# Altium project DM3370.PrjPcb (part 5 of 14)

## Sheet DM3370_Motor.SchDoc: =project_title
size Tabloid; CompanyName: Luxonis Holding; DrawnBy: David Malovrh; Organization: Luxonis Holding; Address1: 7901 Shaffer Parkway; Address2: Littleton, CO; Address3: 80127; Address4: United States; DocumentNumber: 14; Revision: R5M2E5; SheetNumber: 14; SheetTotal: 17
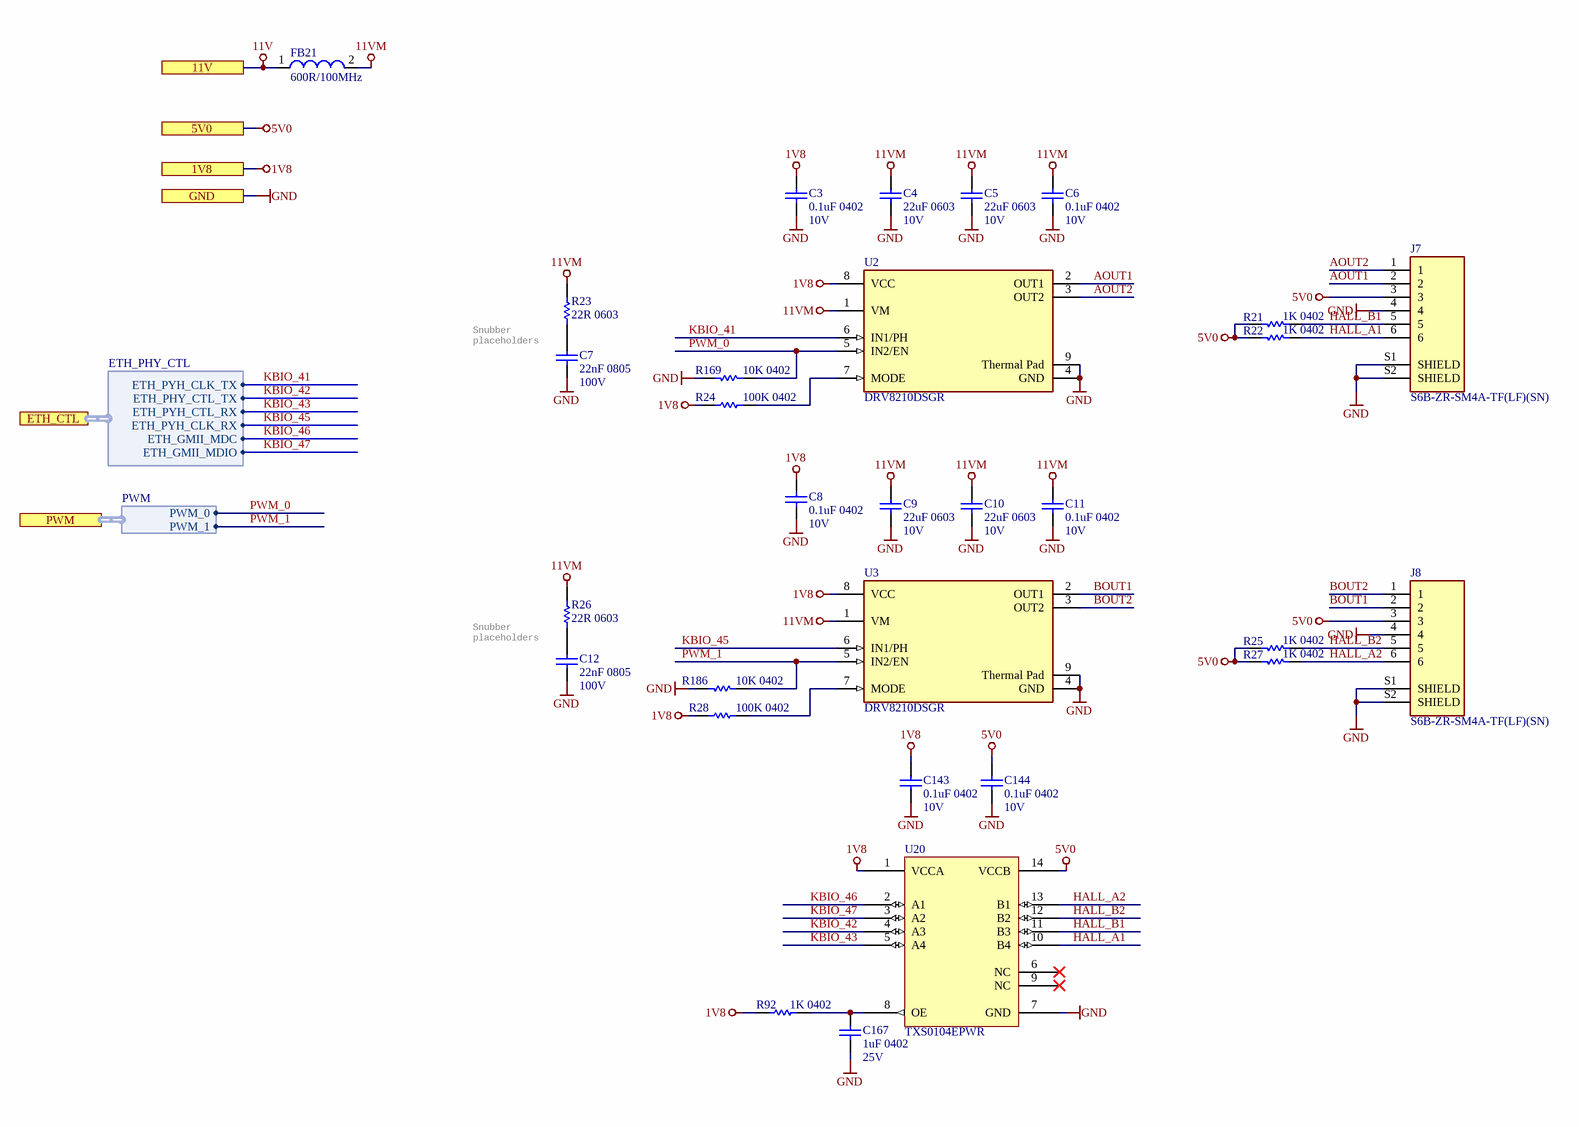
[diagram p8: DM3370_Motor.SchDoc]

### Parts
C3  0.1uF 0402  Voltage Rating: 10V  [CAPC0402(1005)70_L]
C4  22uF 0603  Voltage Rating: 10V  [CAPC0603(1608)100_L]
C5  22uF 0603  Voltage Rating: 10V  [CAPC0603(1608)100_L]
C6  0.1uF 0402  Voltage Rating: 10V  [CAPC0402(1005)70_L]
C7  22nF 0805  Rated DC Voltage (URdc): 100V  [CAPC0805(2012)145_L]
C8  0.1uF 0402  Voltage Rating: 10V  [CAPC0402(1005)70_L]
C9  22uF 0603  Voltage Rating: 10V  [CAPC0603(1608)100_L]
C10  22uF 0603  Voltage Rating: 10V  [CAPC0603(1608)100_L]
C11  0.1uF 0402  Voltage Rating: 10V  [CAPC0402(1005)70_L]
C12  22nF 0805  Rated DC Voltage (URdc): 100V  [CAPC0805(2012)145_L]
C143  0.1uF 0402  Voltage Rating: 10V  [CAPC0402(1005)70_L]
C144  0.1uF 0402  Voltage Rating: 10V  [CAPC0402(1005)70_L]
C167  1uF 0402  Voltage Rating: 25V  [CAPC0402(1005)70_L]
FB21  600R/100MHz  [2508056017Y2]
J7  S6B-ZR-SM4A-TF(LF)(SN)  [FP-S6B-ZR-SM4A-TF_LF_SN-MFG]
J8  S6B-ZR-SM4A-TF(LF)(SN)  [FP-S6B-ZR-SM4A-TF_LF_SN-MFG]
R21  1K 0402  [RESC0402(1005)_L]
R22  1K 0402  [RESC0402(1005)_L]
R23  22R 0603  [RESC0603(1608)_L]
R24  100K 0402  [RESC0402(1005)_L]
R25  1K 0402  [RESC0402(1005)_L]
R26  22R 0603  [RESC0603(1608)_L]
R27  1K 0402  [RESC0402(1005)_L]
R28  100K 0402  [RESC0402(1005)_L]
R92  1K 0402  [RESC0402(1005)_L]
R169  10K 0402  [RESC0402(1005)_L]
R186  10K 0402  [RESC0402(1005)_L]
U2  DRV8210DSGR  [FP-DSG0008A-MFG]
U3  DRV8210DSGR  [FP-DSG0008A-MFG]
U20  TXS0104EPWR  [TXS0104EPWR]

### Ports
1V8, 5V0, 11V, ETH_CTL (harness ETH_PHY_CTL), GND, PWM (harness PWM)

### Harnesses
ETH_PHY_CTL: ETH_PYH_CLK_TX, ETH_PHY_CTL_TX, ETH_PYH_CTL_RX, ETH_PYH_CLK_RX, ETH_GMII_MDC, ETH_GMII_MDIO
PWM: PWM_0, PWM_1

### Nets
1V8: C3.2 C8.2 C143.2 R24.1 R28.1 R92.2 U2.8(VCC) U3.8(VCC) U20.1(VCCA) ; port 1V8
5V0: C144.2 J7.3 J8.3 R21.2 R22.2 R25.2 R27.2 U20.14(VCCB) ; port 5V0
11V: FB21.1 ; port 11V
11VM: C4.2 C5.2 C6.2 C9.2 C10.2 C11.2 FB21.2 R23.2 R26.2 U2.1(VM) U3.1(VM)
GND: C3.1 C4.1 C5.1 C6.1 C7.1 C8.1 C9.1 C10.1 C11.1 C12.1 C143.1 C144.1 C167.1 J7.4 J7.S1(SHIELD) J7.S2(SHIELD) J8.4 J8.S1(SHIELD) J8.S2(SHIELD) R169.2 R186.2 U2.4(GND) U2.9(Thermal_Pad) U3.4(GND) U3.9(Thermal_Pad) U20.7(GND) ; port GND
AOUT1: J7.2 U2.2(OUT1)
AOUT2: J7.1 U2.3(OUT2)
BOUT1: J8.2 U3.2(OUT1)
BOUT2: J8.1 U3.3(OUT2)
HALL_A1: J7.6 R22.1 U20.10(B4)
HALL_A2: J8.6 R27.1 U20.13(B1)
HALL_B1: J7.5 R21.1 U20.11(B3)
HALL_B2: J8.5 R25.1 U20.12(B2)
KBIO_41: U2.6(IN1/PH) ; port ETH_CTL.ETH_PYH_CLK_TX
KBIO_42: U20.4(A3) ; port ETH_CTL.ETH_PHY_CTL_TX
KBIO_43: U20.5(A4) ; port ETH_CTL.ETH_PYH_CTL_RX
KBIO_45: U3.6(IN1/PH) ; port ETH_CTL.ETH_PYH_CLK_RX
KBIO_46: U20.2(A1) ; port ETH_CTL.ETH_GMII_MDC
KBIO_47: U20.3(A2) ; port ETH_CTL.ETH_GMII_MDIO
PWM_0: R169.1 U2.5(IN2/EN) ; port PWM.PWM_0
PWM_1: R186.1 U3.5(IN2/EN) ; port PWM.PWM_1
NetC7_2: C7.2 R23.1
NetC12_2: C12.2 R26.1
NetC167_2: C167.2 R92.1 U20.8(OE)
NetR24_2: R24.2 U2.7(MODE)
NetR28_2: R28.2 U3.7(MODE)

Not connected (* = marked no-connect by the designer): U20 6(NC)* 9(NC)*

### Notes on the sheet
- Snubber placeholders
- Title
- Size:
- Date:
- Tabloid
- Number:
- Time:
- Revision:
- Sheet
- of
- Drawn by:

### Library data of the parts
C3 C6 C8 C11 C143 C144 = GRM155R71A104JA01D: as C158 on sheet DM3370_LCD_LEDring; Supplier 1: Digi-Key; Manufacturer Part Number 1: GRM155R71A104JA01D; Stock 1: 1346709; Pricing 1: 1=0.10000, 10=0.02500, 100=0.01130, 500=0.00806, 1000=0.00633, 2500=0.00575, 5000=0.00529 (USD); RoHS: Yes; Mount: Surface Mount; Case/Package: 0402; Case Code (Imperial): 0402; Case Code (Metric): 1005; Min Operating Temperature: -55°C; Max Operating Temperature: 125°C; Tolerance: 5%; Packaging: Tape and Reel; Voltage Rating (DC): 10V; Dielectric: X7R; Package Quantity: 10000; Termination: SMD/SMT; Length: 1mm; Height: 0.5mm; Width: 0.02inch; Thickness: 0.022inch; Depth: 0.5mm; Radiation Hardening: No; Lead Free: Lead Free; ComponentLink1URL: https://datasheet.ciiva.com/5411/product-5411135.pdf?src-supplier=Mouser; ComponentLink1Description: https://datasheet.ciiva.com/5411/product-5411135.pdf?src-supplier=Mouser; ComponentLink2URL: https://datasheet.ciiva.com/11618/c02e-11618821.pdf?src-supplier=Avnet; ComponentLink2Description: https://datasheet.ciiva.com/11618/c02e-11618821.pdf?src-supplier=Avnet; Supplier Part Number 1: 490-10777-1-ND
C4 C5 C9 C10 = GRM188R61A226ME15D: CAP CER 22UF 10V X5R 0603 20%; Manufacturer 1: Murata; Material: Ceramic; ComponentLink1URL: https://datasheet.ciiva.com/46444/1769893-46444975.pdf?src-supplier=Element14; ComponentLink1Description: https://datasheet.ciiva.com/46444/1769893-46444975.pdf?src-supplier=Element14; Supplier 1: Digi-Key; Manufacturer Part Number 1: GRM188R61A226ME15D; Stock 1: 984716; Pricing 1: 1=0.31000, 10=0.21500, 100=0.12160, 500=0.08584, 1000=0.07512 (USD); RoHS: Yes; Mount: Surface Mount; Case/Package: 0603; Weight: 0.000222oz; Case Code (Metric): 1608; Case Code (Imperial): 0603; Min Operating Temperature: -55°C; Max Operating Temperature: 85°C; Capacitance: 22uF; Tolerance: 20%; Packaging: Tape and Reel; Dielectric: X5R; Voltage Rating (DC): 10V; Termination: SMD/SMT; Package Quantity: 4000; Length: 1.6mm; Height: 0.8mm; Width: 0.8mm; Thickness: 0.039inch; Depth: 0.8mm; REACH SVHC: No SVHC; Lead Free: Lead Free; Supplier Part Number 1: 490-10476-1-ND
C7 C12 = C0805C223M1RACAUTO: CAP CER 22nF 100V X7R 0805; Manufacturer 1: KEMET; Dielectric Material: Ceramic; Multilayer: Yes; Negative Tolerance: 20%; Reference Standard: AEC-Q200; Supplier 1: Digi-Key; RoHS: Yes; Category: Ceramic Capacitors; Mount: Surface Mount; Number of Pins: 2; Package Shape: Rectangular; Size Code: 0805; Terminal Finish: Nickel; Min Operating Temperature: -55°C; Max Operating Temperature: 125°C; JESD-609 Code: e3; Capacitance: 22nF; Capacitor Type: Ceramic; Package Style: SMTMeter; Packaging: Tape and Reel; Positive Tolerance: 20%; Temperature Characteristics Code: X7R; Termination: Wraparound; Length: 2mm; Width: 1.25mm; Height: 0.9mm; REACH SVHC: Yes; RoHS Compliant: Yes; ComponentLink1URL: https://datasheet.ciiva.com:443/pdfs/VipMasterIC/IC/KEME/KEME-S-A0009891634/KEME-S-A0009891634-1.pdf?src-supplier=IHS+Markit; ComponentLink1Description: https://datasheet.ciiva.com:443/pdfs/VipMasterIC/IC/KEME/KEME-S-A0009891634/KEME-S-A0009891634-1.pdf?src-supplier=IHS+Markit; ComponentLink2URL: http://components.arrow.com/part/dataview/0323_00327945?src-supplier=Arrow+Europe; ComponentLink2Description: http://components.arrow.com/part/dataview/0323_00327945?src-supplier=Arrow+Europe; ComponentLink3URL: http://capacitoredge.kemet.com/capedge2/DataSheet/Datasheet-C0805C223M1RACAUTO.pdf?pn=C0805C223M1RACAUTO&src-supplier=Avnet; ComponentLink3Description: http://capacitoredge.kemet.com/capedge2/DataSheet/Datasheet-C0805C223M1RACAUTO.pdf?pn=C0805C223M1RACAUTO&src-supplier=Avnet; ComponentLink4URL: http://www.kemet.com/docfinder?Partnumber=C0805C223M1RACAUTO&src-supplier=Digi-Key; ComponentLink4Description: http://www.kemet.com/docfinder?Partnumber=C0805C223M1RACAUTO&src-supplier=Digi-Key; ComponentLink5URL: https://api.kemet.com/component-edge/download/datasheet/C0805C223M1RACAUTO.pdf?src-supplier=Digi-Key; ComponentLink5Description: https://api.kemet.com/component-edge/download/datasheet/C0805C223M1RACAUTO.pdf?src-supplier=Digi-Key; Supplier Part Number 1: 399-13000-1-ND; Manufacturer Part Number 1: C0805C223M1RACAUTO; Stock 1: 7581; Pricing 1: 1=0,33000, 10=0,22700, 50=0,15900, 100=0,13630, 500=0,10222, 1000=0,08632 (USD)
C167 = GRM155R61E105KA12D: as C160 on sheet DM3370_LCD_LEDring; Supplier 1: Digi-Key; Manufacturer Part Number 1: GRM155R61E105KA12D; Stock 1: 200653; Pricing 1: 1=0.10000, 10=0.07100, 100=0.03350, 500=0.02352, 1000=0.01947, 2500=0.01812, 5000=0.01658 (USD); RoHS: Yes; Mount: Surface Mount; Case/Package: 0402; Weight: 0.000212oz; Case Code (Metric): 1005; Case Code (Imperial): 0402; Min Operating Temperature: -55°C; Max Operating Temperature: 85°C; Tolerance: 10%; Capacitance: 1uF; Dielectric: X5R; Voltage Rating (DC): 25V; Packaging: Tape and Reel; Package Quantity: 10000; Termination: SMD/SMT; Voltage: 25V; Length: 1mm; Height: 0.5mm; Width: 0.5mm; Thickness: 0.022inch; Depth: 0.5mm; Lead Free: Lead Free; REACH SVHC: No SVHC; ComponentLink1URL: https://datasheet.ciiva.com/22732/1666664-22732122.pdf?src-supplier=Element14; ComponentLink1Description: https://datasheet.ciiva.com/22732/1666664-22732122.pdf?src-supplier=Element14; ComponentLink2URL: https://datasheet.ciiva.com/7719/1666664-7719006.pdf?src-supplier=Element14; ComponentLink2Description: https://datasheet.ciiva.com/7719/1666664-7719006.pdf?src-supplier=Element14; Supplier Part Number 1: 490-10017-1-ND; Supplier 2: Arrow; Supplier 3: TTI; Supplier Part Number 2: GRM155R61E105KA12D; Supplier Part Number 3: GRM155R61E105KA12D
FB21 = 2508056017Y2: as FB7 on sheet DM3370_LCD_LEDring; Manufacturer Part Number 1: 2508056017Y2; Supplier 1: Digi-Key; Stock 1: 100491; Pricing 1: 1=0.10000, 10=0.07900, 25=0.07120, 50=0.05240, 100=0.04520, 250=0.03568, 500=0.03014, 1000=0.02538 (USD); RoHS: Yes; Case/Package: 0805; Number of Pins: 2; Case Code (Metric): 2012; Case Code (Imperial): 0805; Min Operating Temperature: -55°C; Max Operating Temperature: 125°C; Package Quantity: 4000; Packaging: Tape and Reel; Max DC Current: 2A; Termination: SMD/SMT; Military Standard: Not; DC Current: 2A; Current Rating: 2A; Frequency: 100MHz; Length: 2mm; Height: 0.9mm; Width: 1.25mm; Depth: 1.25mm; Radiation Hardening: No; REACH SVHC: No SVHC; ComponentLink1URL: https://datasheet.ciiva.com/3854/3802508056017y2-3854245.pdf?src-supplier=Arrow; ComponentLink1Description: https://datasheet.ciiva.com/3854/3802508056017y2-3854245.pdf?src-supplier=Arrow; ComponentLink2URL: https://datasheet.ciiva.com/22735/652149-22735047.pdf?src-supplier=Element14; ComponentLink2Description: https://datasheet.ciiva.com/22735/652149-22735047.pdf?src-supplier=Element14; ComponentLink3URL: https://datasheet.ciiva.com/1127/26143-1127514.pdf?src-supplier=Farnell; ComponentLink3Description: https://datasheet.ciiva.com/1127/26143-1127514.pdf?src-supplier=Farnell; ComponentLink4URL: https://datasheet.ciiva.com/18090/getdatasheetpartid-212640-18090187.pdf?src-supplier=Verical; ComponentLink4Description: https://datasheet.ciiva.com/18090/getdatasheetpartid-212640-18090187.pdf?src-supplier=Verical; ComponentLink5URL: https://datasheet.ciiva.com/7620/26143-7620140.pdf?src-supplier=Element14; ComponentLink5Description: https://datasheet.ciiva.com/7620/26143-7620140.pdf?src-supplier=Element14; Supplier Part Number 1: 1934-1487-1-ND
J7 J8 = CMP-002-00087-2: Connector Header, ZH Series, 6 Position, 1.5mm, Surface Mount Right Angle, Detent Lock, Natural; Manufacturer 1: JST; Current Rating: 1A; Number of Positions: 6; Max Voltage Rating (DC): 50V; Contact Resistance: 30mR; Gender: Male; Fastening Type: Detent; Min Operating Temperature: -25°C; Packaging: Tape and Reel; Max Current Rating: 1A; Number of Contacts: 6; Width: 3.5mm; Contact Type: Male Pin; Insulation Material: Nylon; Lead Free: Lead Free; Manufacturer Part Number 1: S6B-ZR-SM4A-TF(LF)(SN); Depth: 6.5mm; Series: ZH; Max Voltage Rating (AC): 50V; Contact Finish - Mating: TIN; Insulation Color: Natural; Color: Natural; Flammability Rating: UL94 V-0; Orientation: Right Angle; Housing Color: Beige; Length: 12mm; Voltage Rating: 50V; Termination: Solder; Max Operating Temperature: 85°C; Contact Shape: Circular; Connector Type: Header; Housing Material: Polyamide; Contact Material: Brass,Tin; Number of Rows: 1; Mount: Surface Mount; Height: 7.2mm; Pitch: 1.5mm; Contact Plating: Copper,Tin
R21 R22 R25 R27 R92 = RC0402FR-071KL: as R176 on sheet DM3370_LCD_LEDring; RoHS: Yes; Number of Pins: 2; Case Code (Imperial): 0402; Case Code (Metric): 1005; Min Operating Temperature: -55°C; Max Operating Temperature: 155°C; Packaging: Tape and Reel; Composition: Thick Film; Voltage Rating: 50V; Military Standard: Not; Termination: SMD/SMT; Length: 1mm; Height: 0.32mm; Width: 0.5mm; Depth: 0.5mm; Lead Free: Lead Free; REACH SVHC: Unknown; ComponentLink1URL: https://datasheet.ciiva.com/11819/0900766b80c66297-11819477.pdf?src-supplier=RSComponents; ComponentLink1Description: https://datasheet.ciiva.com/11819/0900766b80c66297-11819477.pdf?src-supplier=RSComponents; ComponentLink2URL: https://datasheet.ciiva.com/12666/pyu-rc0402-51-rohs-l-6-r-12666741.pdf?src-supplier=Mouser; ComponentLink2Description: https://datasheet.ciiva.com/12666/pyu-rc0402-51-rohs-l-6-r-12666741.pdf?src-supplier=Mouser; ComponentLink3URL: https://datasheet.ciiva.com/17063/pyu-rc0402-51-rohs-l-6-r-17063193.pdf?src-supplier=Future+Electronics; ComponentLink3Description: https://datasheet.ciiva.com/17063/pyu-rc0402-51-rohs-l-6-r-17063193.pdf?src-supplier=Future+Electronics; ComponentLink4URL: https://datasheet.ciiva.com/22747/1018594-22747513.pdf?src-supplier=Element14; ComponentLink4Description: https://datasheet.ciiva.com/22747/1018594-22747513.pdf?src-supplier=Element14; ComponentLink5URL: https://datasheet.ciiva.com/7849/1018594-7849869.pdf?src-supplier=Element14; ComponentLink5Description: https://datasheet.ciiva.com/7849/1018594-7849869.pdf?src-supplier=Element14; ComponentLink6URL: https://datasheet.ciiva.com/7983/1018594-7983502.pdf?src-supplier=Element14; ComponentLink6Description: https://datasheet.ciiva.com/7983/1018594-7983502.pdf?src-supplier=Element14; ComponentLink7URL: https://datasheet.ciiva.com/7849/1018594-7849871.pdf?src-supplier=Element14; ComponentLink7Description: https://datasheet.ciiva.com/7849/1018594-7849871.pdf?src-supplier=Element14; Supplier 1: Digi-Key; Manufacturer Part Number 1: RC0402FR-071KL; Stock 1: 60695854; Pricing 1: 1=0.10000, 10=0.01600, 100=0.00670, 1000=0.00301, 2500=0.00261, 5000=0.00215 (USD); Case/Package: 0402; Tolerance: 1%; Supplier Part Number 1: 311-1.00KLRCT-ND
R23 R26 = RC0603FR-0722RL: RES SMD 22 OHM 1% 1/10W 0603; Manufacturer 1: Yageo; Temperature Coefficient: 100ppm/°C; Power Rating: 100mW; Voltage Rating: 50V; Supplier 1: Digi-Key; Manufacturer Part Number 1: RC0603FR-0722RL; Stock 1: 3640176; Pricing 1: 1=0.10000, 10=0.02300, 100=0.00940, 1000=0.00421, 2500=0.00366 (USD); RoHS: Yes; Case/Package: 0603; Number of Pins: 2; Case Code (Metric): 1608; Case Code (Imperial): 0603; Min Operating Temperature: -55°C; Max Operating Temperature: 155°C; Tolerance: 1%; Resistance: 22R; Packaging: Tape and Reel; Composition: Thick Film; Voltage Rating (DC): 50V; Package Quantity: 1; Termination: SMD/SMT; Military Standard: Not; Number of Terminations: 2; Max Power Dissipation: 100mW; Features: Moisture Resistant; Length: 1.6mm; Height: 0.022inch; Width: 0.031inch; Depth: 0.8mm; REACH SVHC: No SVHC; Lead Free: Lead Free; ComponentLink1URL: https://datasheet.ciiva.com/11819/0900766b80f96399-11819285.pdf?src-supplier=RSComponents; ComponentLink1Description: https://datasheet.ciiva.com/11819/0900766b80f96399-11819285.pdf?src-supplier=RSComponents; ComponentLink2URL: https://datasheet.ciiva.com/2454/pyu-r-int-thick-7-2454354.pdf?src-supplier=Digi-Key; ComponentLink2Description: https://datasheet.ciiva.com/2454/pyu-r-int-thick-7-2454354.pdf?src-supplier=Digi-Key; ComponentLink3URL: https://datasheet.ciiva.com/2454/pyu-r-int-thick-7-2454355.pdf?src-supplier=Digi-Key; ComponentLink3Description: https://datasheet.ciiva.com/2454/pyu-r-int-thick-7-2454355.pdf?src-supplier=Digi-Key; ComponentLink4URL: https://datasheet.ciiva.com/2454/pyu-r-int-thick-7-2454356.pdf?src-supplier=Digi-Key; ComponentLink4Description: https://datasheet.ciiva.com/2454/pyu-r-int-thick-7-2454356.pdf?src-supplier=Digi-Key; ComponentLink5URL: https://datasheet.ciiva.com/46440/1868787-46440901.pdf?src-supplier=Element14; ComponentLink5Description: https://datasheet.ciiva.com/46440/1868787-46440901.pdf?src-supplier=Element14; ComponentLink6URL: https://datasheet.ciiva.com/46395/443971-46395032.pdf?src-supplier=Element14; ComponentLink6Description: https://datasheet.ciiva.com/46395/443971-46395032.pdf?src-supplier=Element14; Supplier 2: Newark; Supplier 3: Mouser; Supplier Part Number 2: 26M6754; Supplier Part Number 3: 603-RC0603FR-0722RL; Supplier Part Number 1: 311-22.0HRCT-ND
R24 R28 = RC0402FR-07100KL: as R145 on sheet DM3370_LCD_LEDring; Supplier 1: Digi-Key; Manufacturer Part Number 1: RC0402FR-07100KL; Stock 1: 50867324; Pricing 1: 1=0.10000, 10=0.01500, 100=0.00600, 1000=0.00270, 2500=0.00235, 5000=0.00194 (USD); RoHS: Yes; Case/Package: 0402; Case Code (Metric): 1005; Case Code (Imperial): 0402; Min Operating Temperature: -55°C; Max Operating Temperature: 155°C; Tolerance: 1%; Packaging: Tape and Reel; Composition: Thick Film; Termination: SMD/SMT; Military Standard: Not; Package Quantity: 1; Number of Terminations: 2; Max Power Dissipation: 63mW; Features: Moisture Resistant; Working Voltage: 50V; Length: 0.039inch; Height: 0.016inch; Width: 0.02inch; Depth: 0.5mm; Lead Free: Lead Free; REACH SVHC: No SVHC; ComponentLink1URL: https://datasheet.ciiva.com/11819/0900766b80c66297-11819452.pdf?src-supplier=RSComponents; ComponentLink1Description: https://datasheet.ciiva.com/11819/0900766b80c66297-11819452.pdf?src-supplier=RSComponents; ComponentLink2URL: https://datasheet.ciiva.com/2453/pyu-r-int-thick-7-2453361.pdf?src-supplier=Digi-Key; ComponentLink2Description: https://datasheet.ciiva.com/2453/pyu-r-int-thick-7-2453361.pdf?src-supplier=Digi-Key; ComponentLink3URL: https://datasheet.ciiva.com/2453/pyu-r-int-thick-7-2453362.pdf?src-supplier=Digi-Key; ComponentLink3Description: https://datasheet.ciiva.com/2453/pyu-r-int-thick-7-2453362.pdf?src-supplier=Digi-Key; ComponentLink4URL: https://datasheet.ciiva.com/2453/pyu-r-int-thick-7-2453363.pdf?src-supplier=Digi-Key; ComponentLink4Description: https://datasheet.ciiva.com/2453/pyu-r-int-thick-7-2453363.pdf?src-supplier=Digi-Key; ComponentLink5URL: https://datasheet.ciiva.com/22747/1018594-22747509.pdf?src-supplier=Element14; ComponentLink5Description: https://datasheet.ciiva.com/22747/1018594-22747509.pdf?src-supplier=Element14; ComponentLink6URL: https://datasheet.ciiva.com/15189/getdatasheetpartid-323696-15189334.pdf?src-supplier=Verical; ComponentLink6Description: https://datasheet.ciiva.com/15189/getdatasheetpartid-323696-15189334.pdf?src-supplier=Verical; ComponentLink7URL: https://datasheet.ciiva.com/12667/pyu-rc0402-51-rohs-l-6-r-12667930.pdf?src-supplier=Mouser; ComponentLink7Description: https://datasheet.ciiva.com/12667/pyu-rc0402-51-rohs-l-6-r-12667930.pdf?src-supplier=Mouser; Supplier 2: Newark; Supplier 3: Mouser; Supplier Part Number 1: 311-100KLRCT-ND; Supplier Part Number 2: 67R9887; Supplier Part Number 3: 603-RC0402FR-07100KL
R169 R186 = RC0402FR-1310KL: as R118 on sheet DM3370_LCD_LEDring; ComponentLink1URL: https://datasheet.ciiva.com/16940/pyu-rc0402-51-rohs-l-6-16940293.pdf?src-supplier=Avnet+Europe; ComponentLink1Description: https://datasheet.ciiva.com/16940/pyu-rc0402-51-rohs-l-6-16940293.pdf?src-supplier=Avnet+Europe; ComponentLink2URL: https://datasheet.ciiva.com/28386/pyu-rc0402-51-rohs-l-6-28386855.pdf?src-supplier=Avnet+Europe; ComponentLink2Description: https://datasheet.ciiva.com/28386/pyu-rc0402-51-rohs-l-6-28386855.pdf?src-supplier=Avnet+Europe; ComponentLink3URL: https://datasheet.ciiva.com/16740/pyu-rc0402-51-rohs-l-6-r-16740602.pdf?src-supplier=Future+Electronics; ComponentLink3Description: https://datasheet.ciiva.com/16740/pyu-rc0402-51-rohs-l-6-r-16740602.pdf?src-supplier=Future+Electronics; ComponentLink4URL: https://datasheet.ciiva.com/8891/pyu-rc0402-51-rohs-l-6-8891339.pdf?src-supplier=Avnet; ComponentLink4Description: https://datasheet.ciiva.com/8891/pyu-rc0402-51-rohs-l-6-8891339.pdf?src-supplier=Avnet; ComponentLink5URL: https://datasheet.ciiva.com/5557/pyu-rc0402-51-rohs-l-6-r-5557997.pdf?src-supplier=Mouser; ComponentLink5Description: https://datasheet.ciiva.com/5557/pyu-rc0402-51-rohs-l-6-r-5557997.pdf?src-supplier=Mouser; ComponentLink6URL: https://datasheet.ciiva.com/7983/1018594-7983533.pdf?src-supplier=Element14; ComponentLink6Description: https://datasheet.ciiva.com/7983/1018594-7983533.pdf?src-supplier=Element14; Supplier 1: Newark; Manufacturer Part Number 1: RC0402FR-1310KL; Stock 1: 62239; Pricing 1: 1=0.10000, 25=0.01200, 100=0.00400, 250=0.00400, 500=0.00300, 1000=0.00300 (USD); RoHS: Yes; Case/Package: 0402; Number of Pins: 2; Contact Plating: Tin,Matte,Lead; Case Code (Imperial): 0402; Case Code (Metric): 1005; Min Operating Temperature: -55°C; Max Operating Temperature: 155°C; Tolerance: 1%; Composition: Thick Film; Packaging: Tape and Reel; Termination: SMD/SMT; Military Standard: Not; Voltage Rating (DC): 50V; Working Voltage: 50V; Number of Terminations: 2; Length: 1mm; Depth: 0.5mm; Radiation Hardening: No; REACH SVHC: No SVHC; Lead Free: Lead Free; Supplier Part Number 1: 67R9960
U2 U3 = CMP-007-000002-1: 11V, 1A BRUSHED DC MOTOR DRIVER; Manufacturer 1: Texas Instruments; Manufacturer Part Number 1: DRV8210DSGR; Design Item ID: DRV8210DSGR; Source: LuxonisMaster.SchLib
U20 = CMP-104-000008-1: Interface Circuit, PDSO14; Manufacturer 1: Texas Instruments; Package Equivalence Code: TSSOP14,.25; Supply Voltage1-Nom: 3.3V; Package Body Material: Plastic; Supply Voltage-Nom: 1.8V; Power Supplies: 1.8/3.3,2.5/5V; Number of Functions: 1; Supply Voltage1-Max: 5.5V; Qualification Status: Not Qualified; Max Supply Voltage: 3.6V; Min Supply Voltage: 1.65V; Supply Voltage1-Min: 2.3V; Number of Pins: 14; ComponentLink6Description: https://datasheet.ciiva.com/14287/txs0104e-14287275.pdf?src-supplier=Avnet; ComponentLink5Description: https://datasheet.ciiva.com/1899/txs0104e-1899558.pdf?src-supplier=Digi-Key; Interface IC Type: INTERFACE CIRCUIT; Temperature Grade: INDUSTRIAL; ComponentLink2URL: https://datasheet.ciiva.com/15096/getdatasheetpartid-172988-15096218.pdf?src-supplier=Verical; ComponentLink1URL: https://www.ti.com:443/lit/ds/symlink/txs0104e.pdf?src-supplier=IHS+Markit; Package Style: SMALL OUTLINE, THIN PROFILE, SHRINK PITCHMeter; ComponentLink6URL: https://datasheet.ciiva.com/14287/txs0104e-14287275.pdf?src-supplier=Avnet; Min Operating Temperature: -40°C; Moisture Sensitivity Level: 1; Stock 1: 9849; Max Operating Temperature: 85°C; ComponentLink4URL: https://datasheet.ciiva.com/1899/txs0104e-1899556.pdf?src-supplier=Digi-Key; RoHS: Yes; RoHS Compliant: Yes; Terminal Position: DUAL; ComponentLink7Description: https://datasheet.ciiva.com/48702/001073825-da-01-en-ic-4bit-non-inv-txs0104epwr-tssop-14-tid-48702635.pdf?src-supplier=Conrad; ComponentLink4Description: https://datasheet.ciiva.com/1899/txs0104e-1899556.pdf?src-supplier=Digi-Key; Terminal Pitch: 0.65mm; Length: 5mm; JESD-609 Code: e4; ComponentLink3Description: https://datasheet.ciiva.com/1899/txs0104e-1899557.pdf?src-supplier=Digi-Key; Category: Voltage Level Shifters; Design Item ID: TXS0104EPWR; Pricing 1: 2000=0,64225 (USD); Source: NG2391C-HM.SchLib; ComponentLink3URL: https://datasheet.ciiva.com/1899/txs0104e-1899557.pdf?src-supplier=Digi-Key; JESD-30 Code: R-PDSO-G14; REACH SVHC: Yes; Manufacturer Part Number 1: TXS0104EPWR; Terminal Finish: Nickel; Terminal Form: Gull Wing; ComponentLink7URL: https://datasheet.ciiva.com/48702/001073825-da-01-en-ic-4bit-non-inv-txs0104epwr-tssop-14-tid-48702635.pdf?src-supplier=Conrad; Package Code: TSSOP; ComponentLink5URL: https://datasheet.ciiva.com/1899/txs0104e-1899558.pdf?src-supplier=Digi-Key; Peak Reflow Temperature (Cel): 260°C; Package Shape: Rectangular; Height - Seated (Max): 1.2mm; ComponentLink1Description: https://www.ti.com:443/lit/ds/symlink/txs0104e.pdf?src-supplier=IHS+Markit; Surface Mount: Yes; ComponentLink2Description: https://datasheet.ciiva.com/15096/getdatasheetpartid-172988-15096218.pdf?src-supplier=Verical; Width: 4.4mm

## Sheet DM3370_OV9782_1-2.SchDoc: =project_title
size Tabloid; PageSetup: Record=PageOptions|CenterHorizontal=True|CenterVertical=True|PrintScale=0.71|XCorrection=1.00|YCorrection=1.00|PrintKind=0|BorderSize=5000000|LeftOffset=0|BottomOffset=0|Orientation=2|PaperLength=1000|PaperWidth=1000|Scale=100|PaperSource=7|PrintQuality=-4|MediaType=1|DitherType=10|PrintScaleMode=1|PaperKind=A4; CompanyName: Luxonis Holding; DrawnBy: David Malovrh; Organization: Luxonis Holding; Address1: 1925 Harmony Park Drive; Address2: Westminster, CO; Address3: 80234; Address4: United States; DocumentNumber: 9; Revision: R5M2E5; SheetNumber: 9; SheetTotal: 17
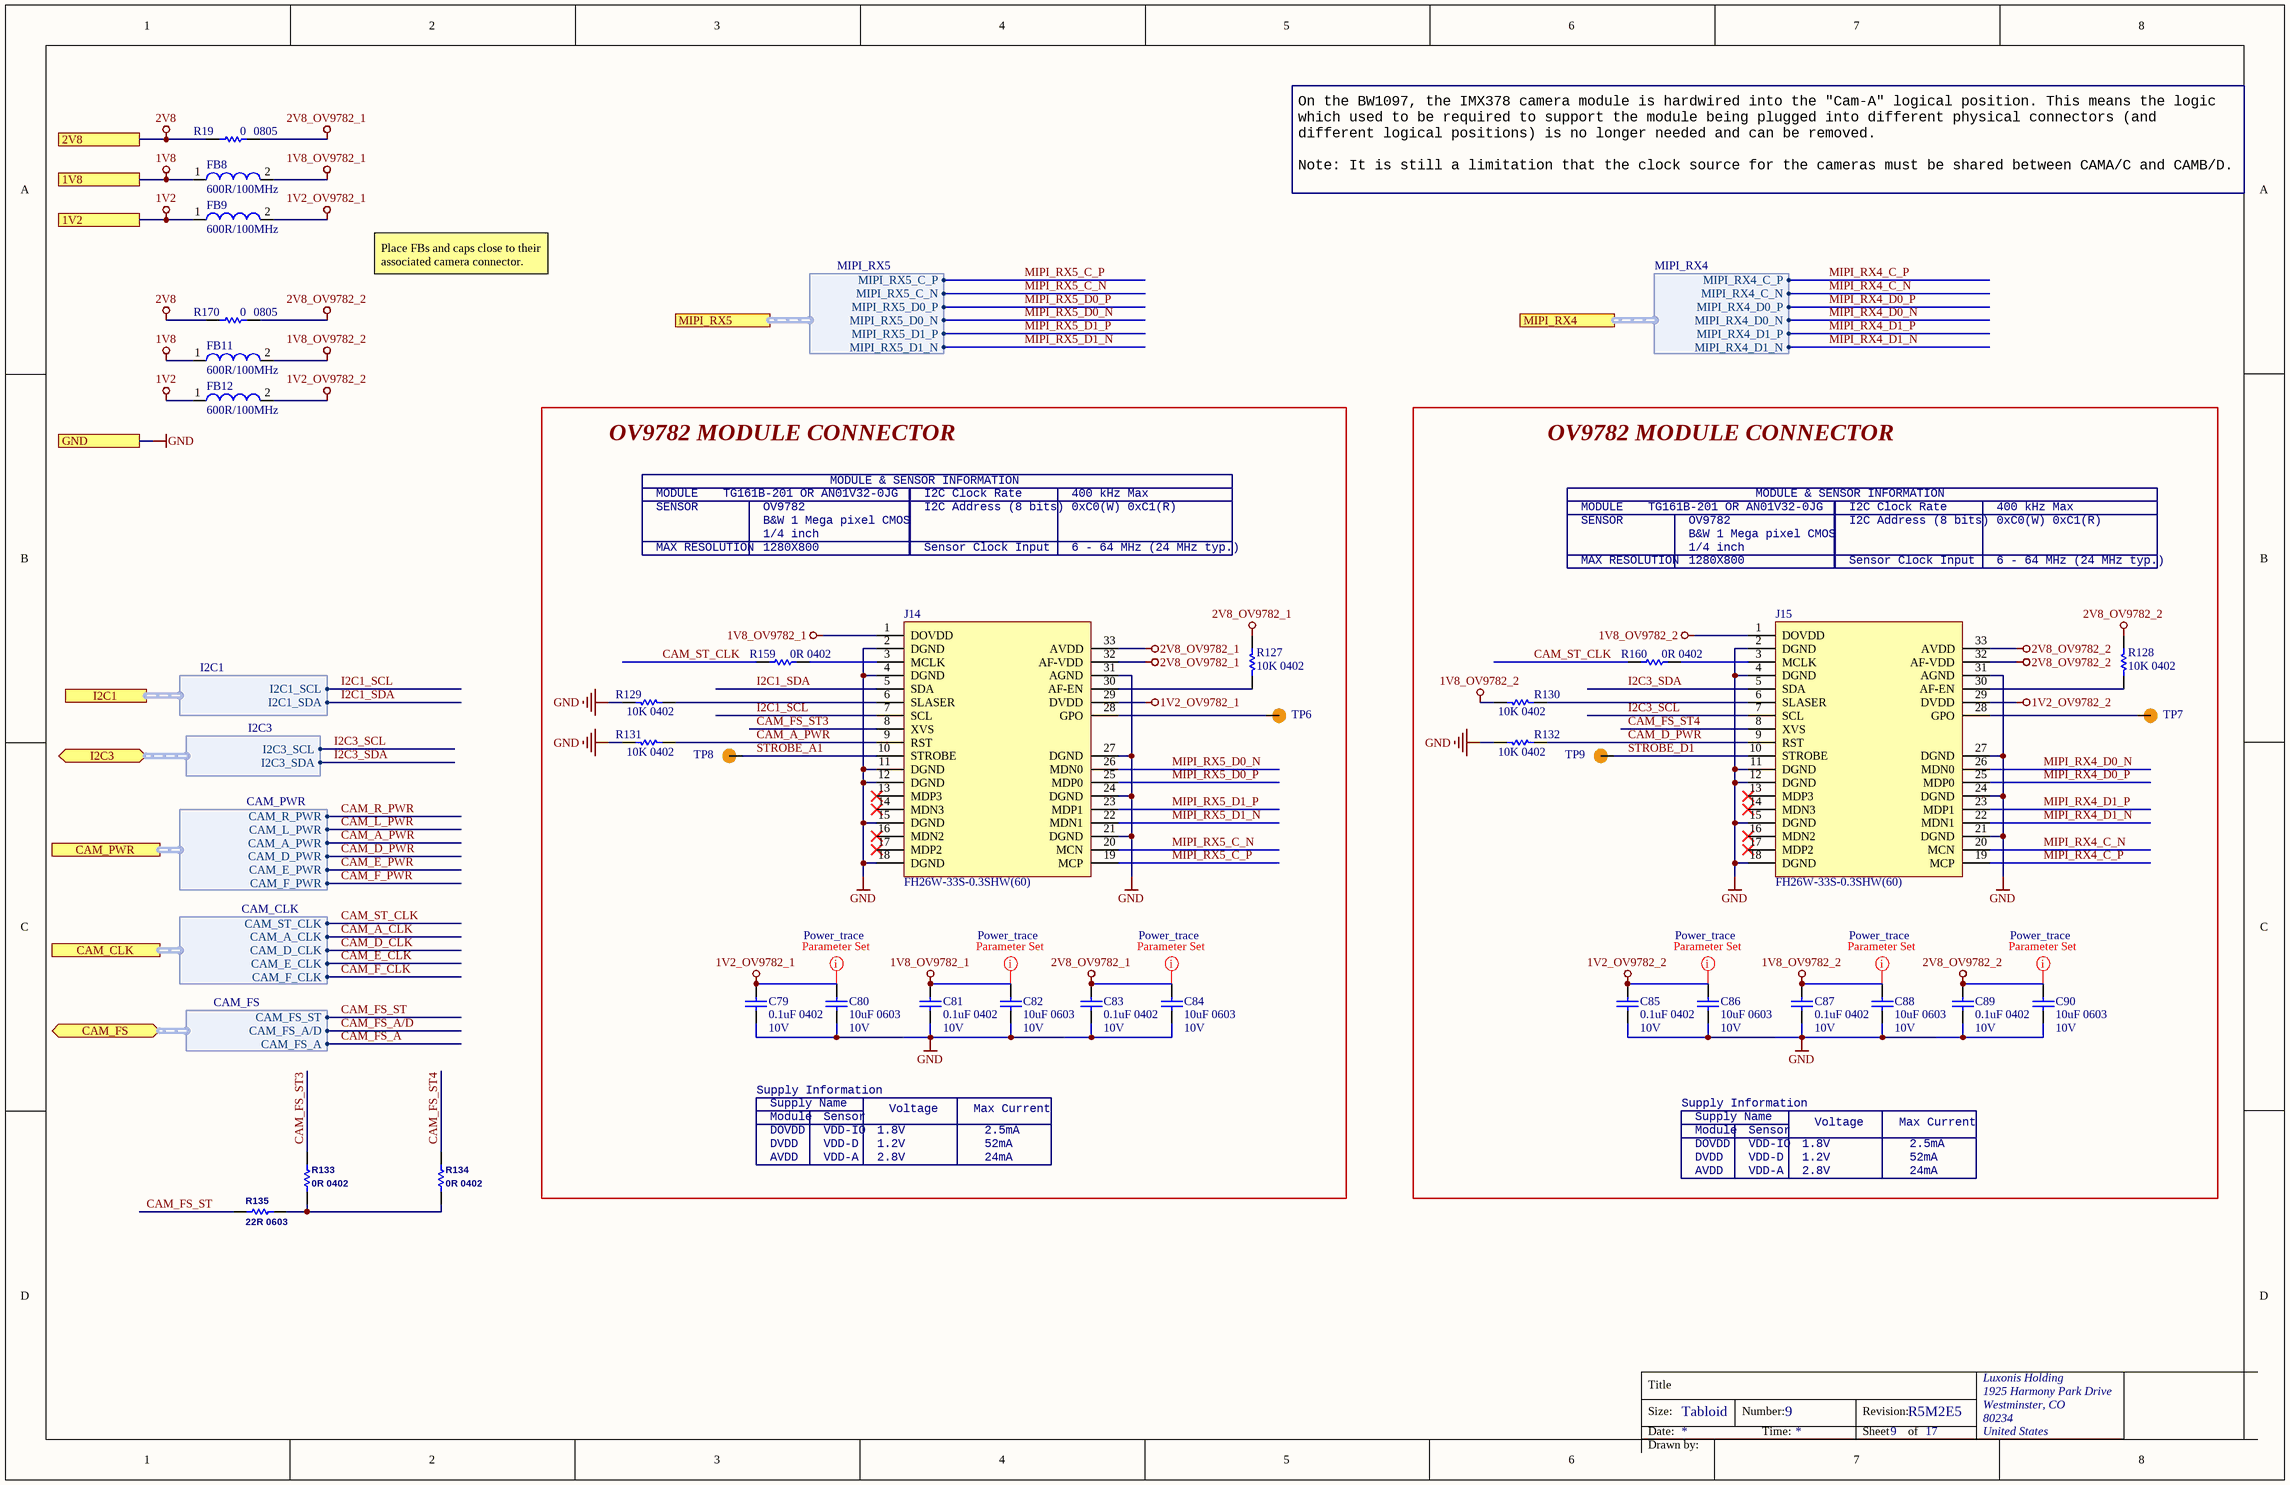
[diagram p9: DM3370_OV9782_1-2.SchDoc]

### Parts
C79  0.1uF 0402  Voltage Rating: 10V  [CAPC0402(1005)70_L]
C80  10uF 0603  Voltage Rating: 10V  [CAPC0603(1608)100_L]
C81  0.1uF 0402  Voltage Rating: 10V  [CAPC0402(1005)70_L]
C82  10uF 0603  Voltage Rating: 10V  [CAPC0603(1608)100_L]
C83  0.1uF 0402  Voltage Rating: 10V  [CAPC0402(1005)70_L]
C84  10uF 0603  Voltage Rating: 10V  [CAPC0603(1608)100_L]
C85  0.1uF 0402  Voltage Rating: 10V  [CAPC0402(1005)70_L]
C86  10uF 0603  Voltage Rating: 10V  [CAPC0603(1608)100_L]
C87  0.1uF 0402  Voltage Rating: 10V  [CAPC0402(1005)70_L]
C88  10uF 0603  Voltage Rating: 10V  [CAPC0603(1608)100_L]
C89  0.1uF 0402  Voltage Rating: 10V  [CAPC0402(1005)70_L]
C90  10uF 0603  Voltage Rating: 10V  [CAPC0603(1608)100_L]
FB8  600R/100MHz  [2508056017Y2]
FB9  600R/100MHz  [2508056017Y2]
FB11  600R/100MHz  [2508056017Y2]
FB12  600R/100MHz  [2508056017Y2]
J14  FH26W-33S-0.3SHW(60)  [FH26W-33S-0.3SHW(60)]
J15  FH26W-33S-0.3SHW(60)  [FH26W-33S-0.3SHW(60)]
R19  value 0  Case/Package: 0805  [RESC0805(2012)_L]  (hidden comment: CRCW08050000Z0EA)
R127  10K 0402  [RESC0402(1005)_L]
R128  10K 0402  [RESC0402(1005)_L]
R129  10K 0402  [RESC0402(1005)_L]
R130  10K 0402  [RESC0402(1005)_L]
R131  10K 0402  [RESC0402(1005)_L]
R132  10K 0402  [RESC0402(1005)_L]
R133  0R 0402  [RESC0402(1005)_L]
R134  0R 0402  [RESC0402(1005)_L]
R135  22R 0603  [RESC0603(1608)_L]
R159  0R 0402  [RESC0402(1005)_L]
R160  0R 0402  [RESC0402(1005)_L]
R170  value 0  Case/Package: 0805  [RESC0805(2012)_L]  (hidden comment: CRCW08050000Z0EA)
TP6  TP100_200_NS  [TP100_200_NS]  (value not drawn)  (no BOM)
TP7  TP100_200_NS  [TP100_200_NS]  (value not drawn)  (no BOM)
TP8  TP100_200_NS  [TP100_200_NS]  (value not drawn)  (no BOM)
TP9  TP100_200_NS  [TP100_200_NS]  (value not drawn)  (no BOM)

### Blocks framed on the sheet
OV9782 MODULE CONNECTOR: C79-C84 J14 R127 R129 R131 R159 TP6 TP8
OV9782 MODULE CONNECTOR: C85-C90 J15 R128 R130 R132 R160 TP7 TP9

### Ports
1V2, 1V8, 2V8, CAM_CLK (harness CAM_CLK), CAM_FS (bidir, harness CAM_FS), CAM_PWR (harness CAM_PWR), GND, I2C1 (harness I2C1), I2C3 (bidir, harness I2C3), MIPI_RX4 (harness MIPI_RX4), MIPI_RX5 (harness MIPI_RX5)

### Harnesses
I2C1: I2C1_SDA, I2C1_SCL
CAM_PWR: CAM_R_PWR, CAM_L_PWR, CAM_A_PWR, CAM_D_PWR, CAM_E_PWR, CAM_F_PWR
CAM_CLK: CAM_ST_CLK, CAM_A_CLK, CAM_D_CLK, CAM_E_CLK, CAM_F_CLK
CAM_FS: CAM_FS_ST, CAM_FS_A/D, CAM_FS_A
I2C3: I2C3_SCL, I2C3_SDA
MIPI_RX4: MIPI_RX4_C_P, MIPI_RX4_C_N, MIPI_RX4_D0_P, MIPI_RX4_D0_N, MIPI_RX4_D1_P, MIPI_RX4_D1_N
MIPI_RX5: MIPI_RX5_C_P, MIPI_RX5_C_N, MIPI_RX5_D0_P, MIPI_RX5_D0_N, MIPI_RX5_D1_P, MIPI_RX5_D1_N

### Nets
1V2: FB9.1 FB12.1 ; port 1V2
1V2_OV9782_1: C79.2 C80.2 FB9.2 J14.29(DVDD)
1V2_OV9782_2: C85.2 C86.2 FB12.2 J15.29(DVDD)
1V8: FB8.1 FB11.1 ; port 1V8
1V8_OV9782_1: C81.2 C82.2 FB8.2 J14.1(DOVDD)
1V8_OV9782_2: C87.2 C88.2 FB11.2 J15.1(DOVDD) R130.2
2V8: R19.1 R170.1 ; port 2V8
2V8_OV9782_1: C83.2 C84.2 J14.32(AF-VDD) J14.33(AVDD) R19.2 R127.1
2V8_OV9782_2: C89.2 C90.2 J15.32(AF-VDD) J15.33(AVDD) R128.1 R170.2
GND: C79.1 C80.1 C81.1 C82.1 C83.1 C84.1 C85.1 C86.1 C87.1 C88.1 C89.1 C90.1 J14.2(DGND) J14.4(DGND) J14.11(DGND) J14.12(DGND) J14.15(DGND) J14.18(DGND) J14.21(DGND) J14.24(DGND) J14.27(DGND) J14.31(AGND) J15.2(DGND) J15.4(DGND) J15.11(DGND) J15.12(DGND) J15.15(DGND) J15.18(DGND) J15.21(DGND) J15.24(DGND) J15.27(DGND) J15.31(AGND) R129.2 R131.2 R132.2 ; port GND
CAM_A_PWR: J14.9(RST) R131.1 ; port CAM_PWR.CAM_A_PWR
CAM_D_CLK: port CAM_CLK.CAM_D_CLK
CAM_D_PWR: J15.9(RST) R132.1 ; port CAM_PWR.CAM_D_PWR
CAM_E_CLK: port CAM_CLK.CAM_E_CLK
CAM_F_CLK: port CAM_CLK.CAM_F_CLK
CAM_F_PWR: port CAM_PWR.CAM_F_PWR
CAM_FS_A/D: port CAM_FS.CAM_FS_A/D
CAM_FS_ST: R135.2 ; port CAM_FS.CAM_FS_ST
CAM_FS_ST3: J14.8(XVS) R133.2
CAM_FS_ST4: J15.8(XVS) R134.2
CAM_ST_CLK: R159.1 R160.1 ; port CAM_CLK.CAM_ST_CLK
I2C1_SCL: J14.7(SCL) ; port I2C1.I2C1_SCL
I2C1_SDA: J14.5(SDA) ; port I2C1.I2C1_SDA
I2C3_SCL: J15.7(SCL) ; port I2C3.I2C3_SCL
I2C3_SDA: J15.5(SDA) ; port I2C3.I2C3_SDA
MIPI_RX4_C_N: J15.20(MCN) ; port MIPI_RX4.MIPI_RX4_C_N
MIPI_RX4_C_P: J15.19(MCP) ; port MIPI_RX4.MIPI_RX4_C_P
MIPI_RX4_D0_N: J15.26(MDN0) ; port MIPI_RX4.MIPI_RX4_D0_N
MIPI_RX4_D0_P: J15.25(MDP0) ; port MIPI_RX4.MIPI_RX4_D0_P
MIPI_RX4_D1_N: J15.22(MDN1) ; port MIPI_RX4.MIPI_RX4_D1_N
MIPI_RX4_D1_P: J15.23(MDP1) ; port MIPI_RX4.MIPI_RX4_D1_P
MIPI_RX5_C_N: J14.20(MCN) ; port MIPI_RX5.MIPI_RX5_C_N
MIPI_RX5_C_P: J14.19(MCP) ; port MIPI_RX5.MIPI_RX5_C_P
MIPI_RX5_D0_N: J14.26(MDN0) ; port MIPI_RX5.MIPI_RX5_D0_N
MIPI_RX5_D0_P: J14.25(MDP0) ; port MIPI_RX5.MIPI_RX5_D0_P
MIPI_RX5_D1_N: J14.22(MDN1) ; port MIPI_RX5.MIPI_RX5_D1_N
MIPI_RX5_D1_P: J14.23(MDP1) ; port MIPI_RX5.MIPI_RX5_D1_P
STROBE_A1: J14.10(STROBE) TP8.1
STROBE_D1: J15.10(STROBE) TP9.1
NetJ14_3: J14.3(MCLK) R159.2
NetJ14_6: J14.6(SLASER) R129.1
NetJ14_28: J14.28(GPO) TP6.1
NetJ14_30: J14.30(AF-EN) R127.2
NetJ15_3: J15.3(MCLK) R160.2
NetJ15_6: J15.6(SLASER) R130.1
NetJ15_28: J15.28(GPO) TP7.1
NetJ15_30: J15.30(AF-EN) R128.2
NetR133_1: R133.1 R134.1 R135.1

Not connected (* = marked no-connect by the designer): J14 13(MDP3)* 14(MDN3)* 16(MDN2)* 17(MDP2)*; J15 13(MDP3)* 14(MDN3)* 16(MDN2)* 17(MDP2)*

### Layout directives
net class Power_trace: 1V2_OV9782_1, 1V2_OV9782_2, 1V8_OV9782_1, 1V8_OV9782_2, 2V8_OV9782_1, 2V8_OV9782_2

### Notes on the sheet
- On the BW1097, the IMX378 camera module is hardwired into the "Cam-A" logical position. This means the logic which used to be required to support the module being plugged into different physical connectors (and different logical positions) is no longer needed and can be removed.
  Note: It is still a limitation that the clock source for the cameras must be shared between CAMA/C and CAMB/D.
- Place FBs and caps close to their associated camera connector.
- MODULE
- TG161B-201 OR AN01V32-0JG
- MODULE & SENSOR INFORMATION
- I2C Clock Rate
- 400 kHz Max
- SENSOR
- MAX RESOLUTION
- B&W 1 Mega pixel CMOS
- 1280X800
- OV9782
- 1/4 inch
- I2C Address (8 bits)
- Sensor Clock Input
- 6 - 64 MHz (24 MHz typ.)
- 0xC0(W) 0xC1(R)
- Supply Information
- Supply Name
- AVDD
- DOVDD
- DVDD
- Module
- VDD-A
- VDD-IO
- VDD-D
- Sensor
- 2.8V
- 1.8V
- 1.2V
- Voltage
- Max Current
- 24mA
- 2.5mA
- 52mA
- Title
- Size:
- Date:
- Tabloid
- Number:
- Time:
- Revision:
- Sheet
- of
- Drawn by:

### Library data of the parts
C79 C81 C83 C85 C87 C89 = GRM155R71A104JA01D: as C158 on sheet DM3370_LCD_LEDring; Manufacturer Part Number 1: GRM155R71A104JA01D; Supplier 1: Digi-Key; Stock 1: 1346709; Pricing 1: 1=0.10000, 10=0.02500, 100=0.01130, 500=0.00806, 1000=0.00633, 2500=0.00575, 5000=0.00529 (USD); RoHS: Yes; Mount: Surface Mount; Case/Package: 0402; Case Code (Imperial): 0402; Case Code (Metric): 1005; Min Operating Temperature: -55°C; Max Operating Temperature: 125°C; Tolerance: 5%; Packaging: Tape and Reel; Voltage Rating (DC): 10V; Dielectric: X7R; Package Quantity: 10000; Termination: SMD/SMT; Length: 1mm; Height: 0.5mm; Width: 0.02inch; Thickness: 0.022inch; Depth: 0.5mm; Radiation Hardening: No; Lead Free: Lead Free; ComponentLink1URL: https://datasheet.ciiva.com/5411/product-5411135.pdf?src-supplier=Mouser; ComponentLink1Description: https://datasheet.ciiva.com/5411/product-5411135.pdf?src-supplier=Mouser; ComponentLink2URL: https://datasheet.ciiva.com/11618/c02e-11618821.pdf?src-supplier=Avnet; ComponentLink2Description: https://datasheet.ciiva.com/11618/c02e-11618821.pdf?src-supplier=Avnet; Supplier Part Number 1: 490-10777-1-ND
C80 C82 C84 C86 C88 C90 = GRM188R61A106ME69D: as C169 on sheet DM3370_LCD_LEDring; Manufacturer Part Number 1: GRM188R61A106ME69D; Supplier 1: Digi-Key; Stock 1: 2873098; Pricing 1: 1=0.21000, 10=0.14100, 100=0.07130, 500=0.04876, 1000=0.04313 (USD); RoHS: Yes; Mount: Surface Mount; Case/Package: 0603; Weight: 0.000222oz; Case Code (Metric): 1608; Case Code (Imperial): 0603; Min Operating Temperature: -55°C; Max Operating Temperature: 85°C; Packaging: Tape and Reel; Tolerance: 20%; Capacitance: 10uF; Dielectric: X5R; Voltage Rating (DC): 10V; Package Quantity: 4000; Termination: SMD/SMT; Length: 1.6mm; Height: 0.8mm; Width: 0.8mm; Thickness: 0.035inch; Depth: 0.8mm; REACH SVHC: Unknown; Lead Free: Lead Free; ComponentLink1URL: http://www.mouser.com/ds/2/281/c02e-2905.pdf?src-supplier=Mouser; ComponentLink1Description: http://www.mouser.com/ds/2/281/c02e-2905.pdf?src-supplier=Mouser; ComponentLink2URL: http://components.arrow.com/part/dataview/0323_06119472?src-supplier=Arrow+Europe; ComponentLink2Description: http://components.arrow.com/part/dataview/0323_06119472?src-supplier=Arrow+Europe; ComponentLink3URL: http://www.farnell.com/datasheets/2048014.pdf?src-supplier=Farnell; ComponentLink3Description: http://www.farnell.com/datasheets/2048014.pdf?src-supplier=Farnell; ComponentLink4URL: http://www.farnell.com/datasheets/1872210.pdf?src-supplier=Farnell; ComponentLink4Description: http://www.farnell.com/datasheets/1872210.pdf?src-supplier=Farnell; ComponentLink5URL: http://search.murata.co.jp/Ceramy/image/img/A01X/G101/ENG/GRM188R61A106ME69-01.pdf?src-supplier=Digi-Key; ComponentLink5Description: http://search.murata.co.jp/Ceramy/image/img/A01X/G101/ENG/GRM188R61A106ME69-01.pdf?src-supplier=Digi-Key; ComponentLink6URL: http://www.farnell.com/datasheets/1872210.pdf?src-supplier=Newark; ComponentLink6Description: http://www.farnell.com/datasheets/1872210.pdf?src-supplier=Newark; ComponentLink7URL: http://www.farnell.com/datasheets/2048014.pdf?src-supplier=Element14; ComponentLink7Description: http://www.farnell.com/datasheets/2048014.pdf?src-supplier=Element14; ComponentLink8URL: http://www.farnell.com/datasheets/2048014.pdf?src-supplier=Newark; ComponentLink8Description: http://www.farnell.com/datasheets/2048014.pdf?src-supplier=Newark; Supplier Part Number 1: 490-10475-1-ND
FB8 FB9 FB11 FB12 = 2508056017Y2: as FB7 on sheet DM3370_LCD_LEDring; Manufacturer Part Number 1: 2508056017Y2; Supplier 1: Digi-Key; Stock 1: 100491; Pricing 1: 1=0.10000, 10=0.07900, 25=0.07120, 50=0.05240, 100=0.04520, 250=0.03568, 500=0.03014, 1000=0.02538 (USD); RoHS: Yes; Case/Package: 0805; Number of Pins: 2; Case Code (Metric): 2012; Case Code (Imperial): 0805; Min Operating Temperature: -55°C; Max Operating Temperature: 125°C; Package Quantity: 4000; Packaging: Tape and Reel; Max DC Current: 2A; Termination: SMD/SMT; Military Standard: Not; DC Current: 2A; Current Rating: 2A; Frequency: 100MHz; Length: 2mm; Height: 0.9mm; Width: 1.25mm; Depth: 1.25mm; Radiation Hardening: No; REACH SVHC: No SVHC; ComponentLink1URL: https://datasheet.ciiva.com/3854/3802508056017y2-3854245.pdf?src-supplier=Arrow; ComponentLink1Description: https://datasheet.ciiva.com/3854/3802508056017y2-3854245.pdf?src-supplier=Arrow; ComponentLink2URL: https://datasheet.ciiva.com/22735/652149-22735047.pdf?src-supplier=Element14; ComponentLink2Description: https://datasheet.ciiva.com/22735/652149-22735047.pdf?src-supplier=Element14; ComponentLink3URL: https://datasheet.ciiva.com/1127/26143-1127514.pdf?src-supplier=Farnell; ComponentLink3Description: https://datasheet.ciiva.com/1127/26143-1127514.pdf?src-supplier=Farnell; ComponentLink4URL: https://datasheet.ciiva.com/18090/getdatasheetpartid-212640-18090187.pdf?src-supplier=Verical; ComponentLink4Description: https://datasheet.ciiva.com/18090/getdatasheetpartid-212640-18090187.pdf?src-supplier=Verical; ComponentLink5URL: https://datasheet.ciiva.com/7620/26143-7620140.pdf?src-supplier=Element14; ComponentLink5Description: https://datasheet.ciiva.com/7620/26143-7620140.pdf?src-supplier=Element14; Supplier Part Number 1: 1934-1487-1-ND
J14 J15 = CMP-002-00090-2: FFC/FPC Connector, 33 Contact(s), 1 Row(s), Female, Right Angle, Surface Mount Terminal; Manufacturer 1: Hirose; Design Item ID: FH26W-33S-0.3SHW(60); Stock 1: 627; ComponentLink2URL: https://www.hirose.com/product/en/download_file/key_name/FH26/category/Catalog/doc_file_id/49355/?file_category_id=4&item_id=298&is_series=1&src-supplier=Digi-Key; Category: FFC / FPC; ComponentLink3Description: https://www.hirose.com/product/download/?distributor=digikey&amp;type=2d&amp;lang=en&amp;num=FH26W-13S-0.3SHW(60)&src-supplier=Digi-Key; Manufacturer Part Number 1: FH26W-33S-0.3SHW(60); ComponentLink1Description: https://datasheet.ciiva.com:443/pdfs/VipMasterIC/IC/HIRO/HIRO-S-A0007913874/HIRO-S-A0008593114-1.pdf?src-supplier=IHS+Markit; ComponentLink1URL: https://datasheet.ciiva.com:443/pdfs/VipMasterIC/IC/HIRO/HIRO-S-A0007913874/HIRO-S-A0008593114-1.pdf?src-supplier=IHS+Markit; RoHS: Yes; ComponentLink3URL: https://www.hirose.com/product/download/?distributor=digikey&amp;type=2d&amp;lang=en&amp;num=FH26W-13S-0.3SHW(60)&src-supplier=Digi-Key; ComponentLink2Description: https://www.hirose.com/product/en/download_file/key_name/FH26/category/Catalog/doc_file_id/49355/?file_category_id=4&item_id=298&is_series=1&src-supplier=Digi-Key; Pricing 1: 1=1,78000, 10=1,61700, 25=1,51800, 50=1,45200, 100=1,38600, 250=1,25400, 500=1,15500, 1000=0,99000, 2500=0,92400 (USD); Source: LuxonisMaster.SchLib
R19 R170 = CMP-013-000034-9: RES SMD 0 OHM 1% 1/8W 0805; Manufacturer 1: Vishay; Power Rating: 125mW; Design Item ID: CRCW08050000Z0EA; Manufacturer Part Number 1: CRCW08050000Z0EA; Max Operating Temperature: 155°C; Min Operating Temperature: -55°C
R127-R132 = RC0402FR-1310KL: as R118 on sheet DM3370_LCD_LEDring; ComponentLink1URL: https://datasheet.ciiva.com/16940/pyu-rc0402-51-rohs-l-6-16940293.pdf?src-supplier=Avnet+Europe; ComponentLink1Description: https://datasheet.ciiva.com/16940/pyu-rc0402-51-rohs-l-6-16940293.pdf?src-supplier=Avnet+Europe; ComponentLink2URL: https://datasheet.ciiva.com/28386/pyu-rc0402-51-rohs-l-6-28386855.pdf?src-supplier=Avnet+Europe; ComponentLink2Description: https://datasheet.ciiva.com/28386/pyu-rc0402-51-rohs-l-6-28386855.pdf?src-supplier=Avnet+Europe; ComponentLink3URL: https://datasheet.ciiva.com/16740/pyu-rc0402-51-rohs-l-6-r-16740602.pdf?src-supplier=Future+Electronics; ComponentLink3Description: https://datasheet.ciiva.com/16740/pyu-rc0402-51-rohs-l-6-r-16740602.pdf?src-supplier=Future+Electronics; ComponentLink4URL: https://datasheet.ciiva.com/8891/pyu-rc0402-51-rohs-l-6-8891339.pdf?src-supplier=Avnet; ComponentLink4Description: https://datasheet.ciiva.com/8891/pyu-rc0402-51-rohs-l-6-8891339.pdf?src-supplier=Avnet; ComponentLink5URL: https://datasheet.ciiva.com/5557/pyu-rc0402-51-rohs-l-6-r-5557997.pdf?src-supplier=Mouser; ComponentLink5Description: https://datasheet.ciiva.com/5557/pyu-rc0402-51-rohs-l-6-r-5557997.pdf?src-supplier=Mouser; ComponentLink6URL: https://datasheet.ciiva.com/7983/1018594-7983533.pdf?src-supplier=Element14; ComponentLink6Description: https://datasheet.ciiva.com/7983/1018594-7983533.pdf?src-supplier=Element14; Supplier 1: Newark; Manufacturer Part Number 1: RC0402FR-1310KL; Stock 1: 62239; Pricing 1: 1=0.10000, 25=0.01200, 100=0.00400, 250=0.00400, 500=0.00300, 1000=0.00300 (USD); RoHS: Yes; Case/Package: 0402; Number of Pins: 2; Contact Plating: Tin,Matte,Lead; Case Code (Imperial): 0402; Case Code (Metric): 1005; Min Operating Temperature: -55°C; Max Operating Temperature: 155°C; Tolerance: 1%; Composition: Thick Film; Packaging: Tape and Reel; Termination: SMD/SMT; Military Standard: Not; Voltage Rating (DC): 50V; Working Voltage: 50V; Number of Terminations: 2; Length: 1mm; Depth: 0.5mm; Radiation Hardening: No; REACH SVHC: No SVHC; Lead Free: Lead Free; Supplier Part Number 1: 67R9960; Supplier 2: Future Electronics; Supplier 3: Mouser; Supplier 4: Element14; Supplier Part Number 2: RC0402FR-1310KL-CUTT; Supplier Part Number 3: 603-RC0402FR-1310KL; Supplier Part Number 4: 1799235
R133 R134 R159 R160 = CRCW04020000Z0ED: as R158 on sheet DM3370_LCD_LEDring; Supplier 1: Digi-Key; Manufacturer Part Number 1: CRCW04020000Z0ED; Stock 1: 855968; Pricing 1: 1=0.10000, 10=0.03400, 25=0.02440, 50=0.01860, 100=0.01380, 250=0.01048, 500=0.00840, 1000=0.00618, 5000=0.00443 (USD); RoHS: Yes; Mount: Surface Mount; Case/Package: 0402; Weight: 2.3E-05oz; Case Code (Imperial): 0402; Case Code (Metric): 1005; Contact Plating: Tin; Min Operating Temperature: -55°C; Max Operating Temperature: 155°C; Packaging: Tape and Reel; Composition: Thick Film; Voltage Rating (DC): 50V; Package Quantity: 1; Termination: SMD/SMT; Number of Terminations: 2; Military Standard: Not; Max Power Dissipation: 63mW; Features: Automotive AEC-Q200; Length: 1mm; Height: 0.35mm; Width: 0.5mm; Depth: 0.5mm; Radiation Hardening: No; REACH SVHC: Unknown; Lead Free: Lead Free; ComponentLink1URL: https://datasheet.ciiva.com/3255/dcrcwe3-3255944.pdf?src-supplier=Avnet; ComponentLink1Description: https://datasheet.ciiva.com/3255/dcrcwe3-3255944.pdf?src-supplier=Avnet; ComponentLink2URL: https://datasheet.ciiva.com/3255/dcrcwe3-3255945.pdf?src-supplier=Avnet; ComponentLink2Description: https://datasheet.ciiva.com/3255/dcrcwe3-3255945.pdf?src-supplier=Avnet; ComponentLink3URL: https://datasheet.ciiva.com/16881/dcrcwe3-16881413.pdf?src-supplier=Avnet+Europe; ComponentLink3Description: https://datasheet.ciiva.com/16881/dcrcwe3-16881413.pdf?src-supplier=Avnet+Europe; ComponentLink4URL: https://datasheet.ciiva.com/2461/dcrcwe3-2461962.pdf?src-supplier=Digi-Key; ComponentLink4Description: https://datasheet.ciiva.com/2461/dcrcwe3-2461962.pdf?src-supplier=Digi-Key; ComponentLink5URL: https://datasheet.ciiva.com/7841/1720486-7841802.pdf?src-supplier=Element14; ComponentLink5Description: https://datasheet.ciiva.com/7841/1720486-7841802.pdf?src-supplier=Element14; ComponentLink6URL: https://datasheet.ciiva.com/2461/dcrcwe3-2461963.pdf?src-supplier=Digi-Key; ComponentLink6Description: https://datasheet.ciiva.com/2461/dcrcwe3-2461963.pdf?src-supplier=Digi-Key; ComponentLink7URL: https://datasheet.ciiva.com/2461/dcrcwe3-2461964.pdf?src-supplier=Digi-Key; ComponentLink7Description: https://datasheet.ciiva.com/2461/dcrcwe3-2461964.pdf?src-supplier=Digi-Key; ComponentLink8URL: https://datasheet.ciiva.com/7841/1697337-7841468.pdf?src-supplier=Element14; ComponentLink8Description: https://datasheet.ciiva.com/7841/1697337-7841468.pdf?src-supplier=Element14; ComponentLink9URL: https://datasheet.ciiva.com/16761/70200976-16761309.pdf?src-supplier=Allied+Electronics; ComponentLink9Description: https://datasheet.ciiva.com/16761/70200976-16761309.pdf?src-supplier=Allied+Electronics; ComponentLink10URL: https://datasheet.ciiva.com/26311/fld-crcw-e3-data-en-26311550.pdf?src-supplier=Distrelec; ComponentLink10Description: https://datasheet.ciiva.com/26311/fld-crcw-e3-data-en-26311550.pdf?src-supplier=Distrelec; Supplier Part Number 1: 541-0.0JCT-ND
R135 = RC0603FR-0722RL: as R23 on sheet DM3370_Motor; Supplier 1: Digi-Key; Manufacturer Part Number 1: RC0603FR-0722RL; Stock 1: 3640176; Pricing 1: 1=0.10000, 10=0.02300, 100=0.00940, 1000=0.00421, 2500=0.00366 (USD); RoHS: Yes; Case/Package: 0603; Number of Pins: 2; Case Code (Metric): 1608; Case Code (Imperial): 0603; Min Operating Temperature: -55°C; Max Operating Temperature: 155°C; Tolerance: 1%; Resistance: 22R; Packaging: Tape and Reel; Composition: Thick Film; Voltage Rating (DC): 50V; Package Quantity: 1; Termination: SMD/SMT; Military Standard: Not; Number of Terminations: 2; Max Power Dissipation: 100mW; Features: Moisture Resistant; Length: 1.6mm; Height: 0.022inch; Width: 0.031inch; Depth: 0.8mm; REACH SVHC: No SVHC; Lead Free: Lead Free; ComponentLink1URL: https://datasheet.ciiva.com/11819/0900766b80f96399-11819285.pdf?src-supplier=RSComponents; ComponentLink1Description: https://datasheet.ciiva.com/11819/0900766b80f96399-11819285.pdf?src-supplier=RSComponents; ComponentLink2URL: https://datasheet.ciiva.com/2454/pyu-r-int-thick-7-2454354.pdf?src-supplier=Digi-Key; ComponentLink2Description: https://datasheet.ciiva.com/2454/pyu-r-int-thick-7-2454354.pdf?src-supplier=Digi-Key; ComponentLink3URL: https://datasheet.ciiva.com/2454/pyu-r-int-thick-7-2454355.pdf?src-supplier=Digi-Key; ComponentLink3Description: https://datasheet.ciiva.com/2454/pyu-r-int-thick-7-2454355.pdf?src-supplier=Digi-Key; ComponentLink4URL: https://datasheet.ciiva.com/2454/pyu-r-int-thick-7-2454356.pdf?src-supplier=Digi-Key; ComponentLink4Description: https://datasheet.ciiva.com/2454/pyu-r-int-thick-7-2454356.pdf?src-supplier=Digi-Key; ComponentLink5URL: https://datasheet.ciiva.com/46440/1868787-46440901.pdf?src-supplier=Element14; ComponentLink5Description: https://datasheet.ciiva.com/46440/1868787-46440901.pdf?src-supplier=Element14; ComponentLink6URL: https://datasheet.ciiva.com/46395/443971-46395032.pdf?src-supplier=Element14; ComponentLink6Description: https://datasheet.ciiva.com/46395/443971-46395032.pdf?src-supplier=Element14; Supplier 2: Newark; Supplier 3: Mouser; Supplier Part Number 2: 26M6754; Supplier Part Number 3: 603-RC0603FR-0722RL; Supplier Part Number 1: 311-22.0HRCT-ND
TP6-TP9 = TEST_POINT